# Altium schematic sheet Strawberry Pi.SchDoc: Strawberry Pi
size A4; Organization: Bjørn T. Brodtkorb; Address1: Frode Rinnans veg 161; Address2: 7050 Trondheim; DocumentNumber: 6598; Revision: 1.0; SheetNumber: 1; SheetTotal: 1
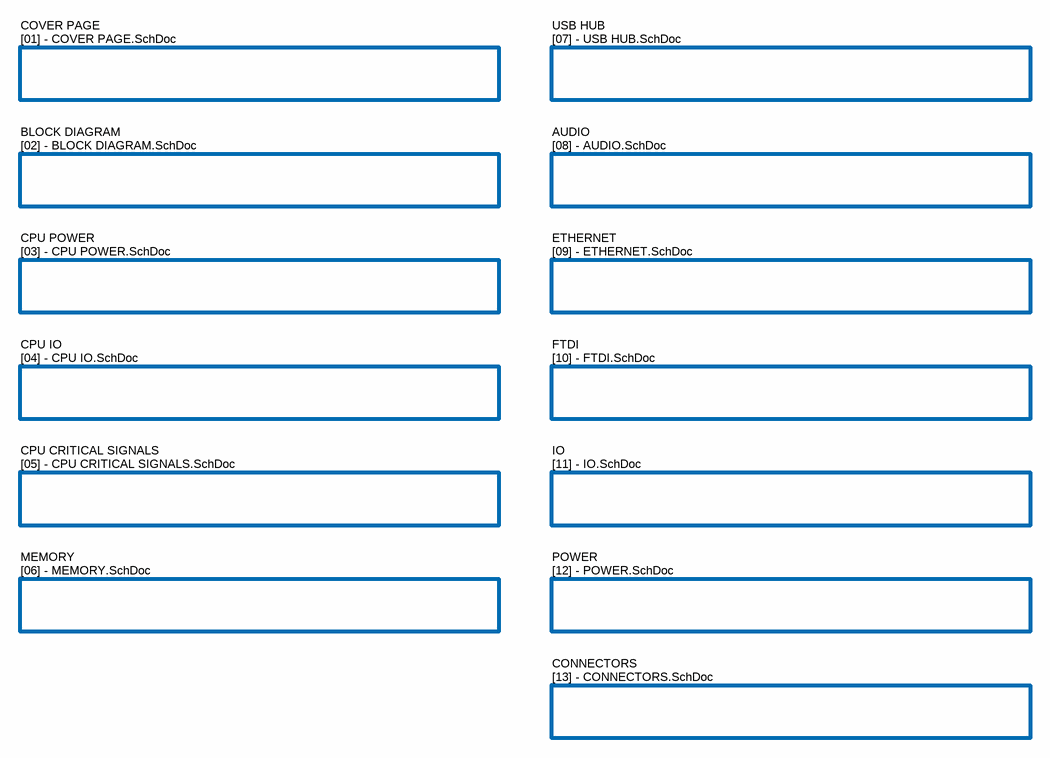
[diagram p0: Strawberry Pi.SchDoc]

## Sub-sheets
AUDIO = [08] - AUDIO.SchDoc: no entries
BLOCK DIAGRAM = [02] - BLOCK DIAGRAM.SchDoc: no entries
CONNECTORS = [13] - CONNECTORS.SchDoc: no entries
COVER PAGE = [01] - COVER PAGE.SchDoc: no entries
CPU CRITICAL SIGNALS = [05] - CPU CRITICAL SIGNALS.SchDoc: no entries
CPU IO = [04] - CPU IO.SchDoc: no entries
CPU POWER = [03] - CPU POWER.SchDoc: no entries
ETHERNET = [09] - ETHERNET.SchDoc: no entries
FTDI = [10] - FTDI.SchDoc: no entries
IO = [11] - IO.SchDoc: no entries
MEMORY = [06] - MEMORY.SchDoc: no entries
POWER = [12] - POWER.SchDoc: no entries
USB HUB = [07] - USB HUB.SchDoc: no entries

## Notes on the sheet
- Title
- Size:
- A4
- Number:
- Revision:
- Date:
- File:
- Time:
- Sheet
- of